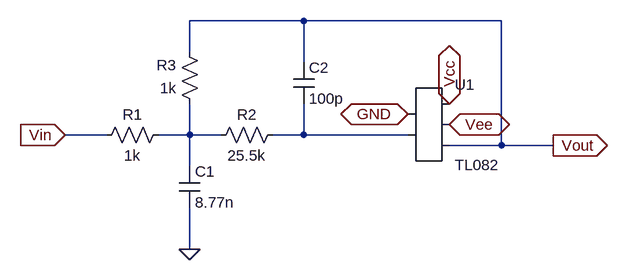
[diagram p0: schematic low-pass-rauch-block3.asc]
low-pass-rauch-block3.asc, the LTspice schematic file:
Version 4
SHEET 1 880 680
WIRE -64 -32 -240 -32
WIRE 240 -32 -64 -32
WIRE -240 16 -240 -32
WIRE -64 32 -64 -32
WIRE -368 144 -432 144
WIRE -240 144 -240 96
WIRE -240 144 -288 144
WIRE -192 144 -240 144
WIRE -64 144 -64 96
WIRE -64 144 -112 144
WIRE 96 144 -64 144
WIRE 240 160 240 -32
WIRE 240 160 160 160
WIRE 320 160 240 160
WIRE -240 192 -240 144
WIRE -240 320 -240 256
FLAG -240 320 0
FLAG -432 144 Vin
IOPIN -432 144 In
FLAG 320 160 Vout
IOPIN 320 160 Out
FLAG 160 96 Vcc
IOPIN 160 96 BiDir
FLAG 160 128 Vee
IOPIN 160 128 BiDir
FLAG 96 112 GND
IOPIN 96 112 BiDir
SYMBOL AutoGenerated\\TL082 128 128 R0
SYMATTR InstName U1
SYMBOL res -272 128 R90
WINDOW 0 0 56 VBottom 2
WINDOW 3 32 56 VTop 2
SYMATTR InstName R1
SYMATTR Value 1k
SYMBOL res -96 128 R90
WINDOW 0 0 56 VBottom 2
WINDOW 3 32 56 VTop 2
SYMATTR InstName R2
SYMATTR Value 25.5k
SYMBOL res -224 112 R180
WINDOW 0 36 76 Left 2
WINDOW 3 36 40 Left 2
SYMATTR InstName R3
SYMATTR Value 1k
SYMBOL cap -256 192 R0
SYMATTR InstName C1
SYMATTR Value 8.77n
SYMBOL cap -80 32 R0
SYMATTR InstName C2
SYMATTR Value 100p

The netlist it stands for:
* low-pass-rauch-block3.asc
* U1: TL082 (symbol AutoGenerated\TL082 not available, pins judged from their places): pin1=GND pin2=N002 pin3=Vcc pin4=Vee pin5=Vout
R1 N001 Vin 1k
R2 N002 N001 25.5k
R3 N001 Vout 1k
C1 N001 0 8.77n
C2 Vout N002 100p
.backanno
.end